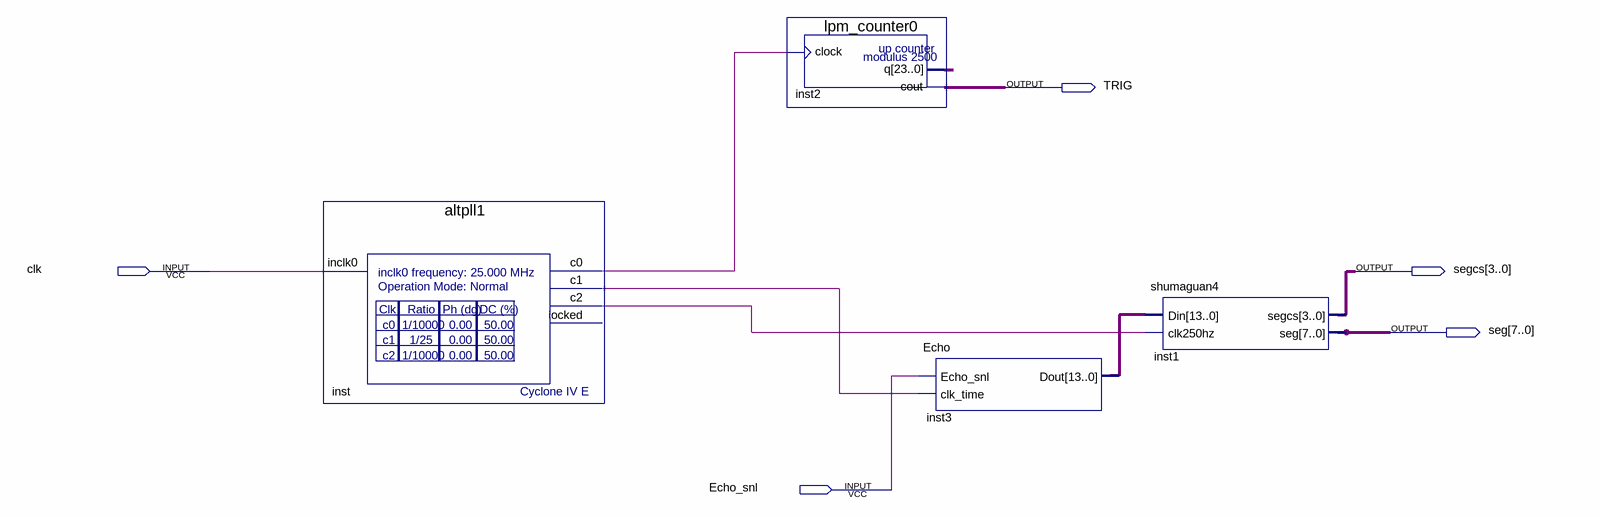
[diagram p0: schematic sheet]
// Quartus schematic csb.bdf as structural Verilog: 4 symbols, 5 pins
module csb (
  input  clk,
  input  Echo_snl,
  output TRIG,
  output [3:0] segcs,
  output [7:0] seg
);

  wire inst_c0, inst_c1, inst_c2;
  wire [13:0] inst3_dout;
  wire [23:0] inst2_q;

  altpll1 inst (.inclk0(clk), .c0(inst_c0), .c1(inst_c1), .c2(inst_c2));  // open: locked
  lpm_counter0 inst2 (.clock(inst_c0), .cout(TRIG), .q(inst2_q));
  Echo inst3 (.Echo_snl(Echo_snl), .clk_time(inst_c1), .Dout(inst3_dout));
  shumaguan4 inst1 (.Din(inst3_dout), .clk250hz(inst_c2), .segcs(segcs), .seg(seg));
endmodule
